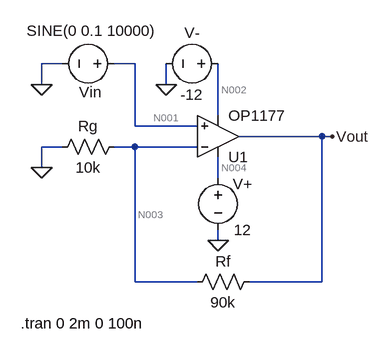
[diagram p0: schematic AFE_Amplifier.asc]
AFE_Amplifier.asc, the LTspice schematic file:
Version 4
SHEET 1 880 680
WIRE -48 48 -80 48
WIRE 64 48 32 48
WIRE -80 80 -80 48
WIRE 112 80 112 48
WIRE 192 128 192 48
WIRE 64 144 64 48
WIRE 160 144 64 144
WIRE 352 160 224 160
WIRE 368 160 352 160
WIRE -48 176 -80 176
WIRE 64 176 32 176
WIRE 160 176 64 176
WIRE -80 208 -80 176
WIRE 192 224 192 192
WIRE 192 320 192 304
WIRE 64 384 64 176
WIRE 160 384 64 384
WIRE 352 384 352 160
WIRE 352 384 240 384
FLAG -80 80 0
FLAG 192 320 0
FLAG 112 80 0
FLAG 368 160 Vout
FLAG -80 208 0
SYMBOL OpAmps\\OP1177 192 224 M180
SYMATTR InstName U1
SYMBOL voltage 48 48 R90
WINDOW 0 59 53 VBottom 2
WINDOW 3 -67 52 VTop 2
WINDOW 123 -35 51 VBottom 2
WINDOW 39 0 0 Left 0
SYMATTR InstName Vin
SYMATTR Value ""
SYMATTR Value2 SINE(0 0.1 10000)
SYMBOL res 256 368 R90
WINDOW 0 0 56 VBottom 2
WINDOW 3 32 56 VTop 2
SYMATTR InstName Rf
SYMATTR Value 90k
SYMBOL res 48 160 R90
WINDOW 0 0 56 VBottom 2
WINDOW 3 32 56 VTop 2
SYMATTR InstName Rg
SYMATTR Value 10k
SYMBOL voltage 192 208 R0
WINDOW 0 23 25 Left 2
SYMATTR InstName V+
SYMATTR Value 12
SYMBOL voltage 208 48 R90
WINDOW 0 -32 56 VBottom 2
WINDOW 3 32 56 VTop 2
SYMATTR InstName V-
SYMATTR Value -12
TEXT -112 448 Left 2 !.tran 0 2m 0 100n

The netlist it stands for:
* AFE_Amplifier.asc
XU1 N001 N003 N004 N002 Vout OP1177  ; pins In+ In- V+ V- OUT
Vin N001 0 SINE(0 0.1 10000)
Rf Vout N003 90k
Rg N003 0 10k
V+ N004 0 12
V- N002 0 -12
.tran 0 2m 0 100n
.lib ADI1.lib
.backanno
.end

* Results of the author's LTspice run, read from the files saved beside the schematic
* Operating Point, zero values left out:
*   V(n003) = -386.8 nV
*   V(n004) = 12 V
*   V(n002) = -12 V
*   V(vout) = -183.9 µV
*   I(Rf) = -2.039 nA
*   I(Rg) = -38.68 pA
*   I(Vin) = 2 nA
*   I(V+) = -500.1 µA
*   I(V-) = 500.1 µA
*   Ix(u1:1) = -2 nA
*   Ix(u1:2) = -2 nA
*   Ix(u1:3) = 500.1 µA
*   Ix(u1:4) = -500.1 µA
*   Ix(u1:5) = 2.039 nA
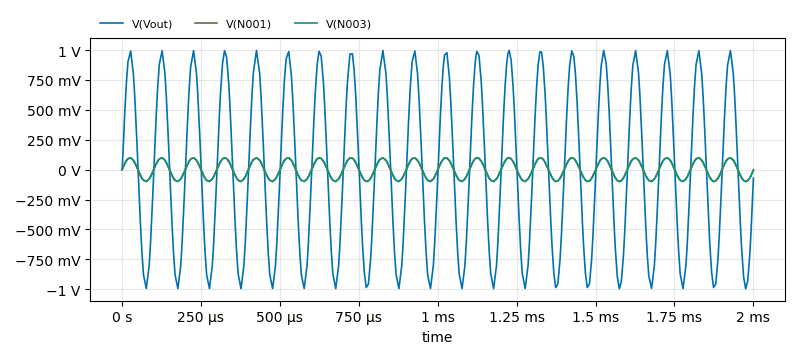
[diagram p1: Transient Analysis of AFE_Amplifier.asc, plotted from the saved traces]
* Transient Analysis, 1 run:
*   V(Vout): min -996.7 mV, max 997.3 mV, average 259.6 µV, rms 697.2 mV, last -71.01 mV
*   V(N001): min -99.97 mV, max 100 mV, average 40.43 µV, rms 69.9 mV, last 0 V
*   V(N003): min -99.64 mV, max 99.75 mV, average 44.08 µV, rms 69.71 mV, last -7.224 mV